# Altium schematic sheet DAC.SchDoc: FMC DAC 1.5GS 4CH
size 420 x 297 mm; EDA_Number: ARTIQ; Projet: ARTIQ/SINARA; Author: G.Kasprowicz; CompanyName: WUT ISE; DrawnBy: G.Kasprowicz; Organization: WUT ISE; Address1: PW ISE; Address2: Nowowiejska 15/19 00-665 Warsaw; Address3: gkasprow@gmail.com; DocumentNumber: 6; Revision: 1; SheetNumber: 6; SheetTotal: 18; ModifiedBy: -; CheckedDate: -; Title2: DAC & filters; DivGrp: WUT ISE; Designer: G.Kasprowicz; ModifiedDate: -; ProjectName: Sensor Box
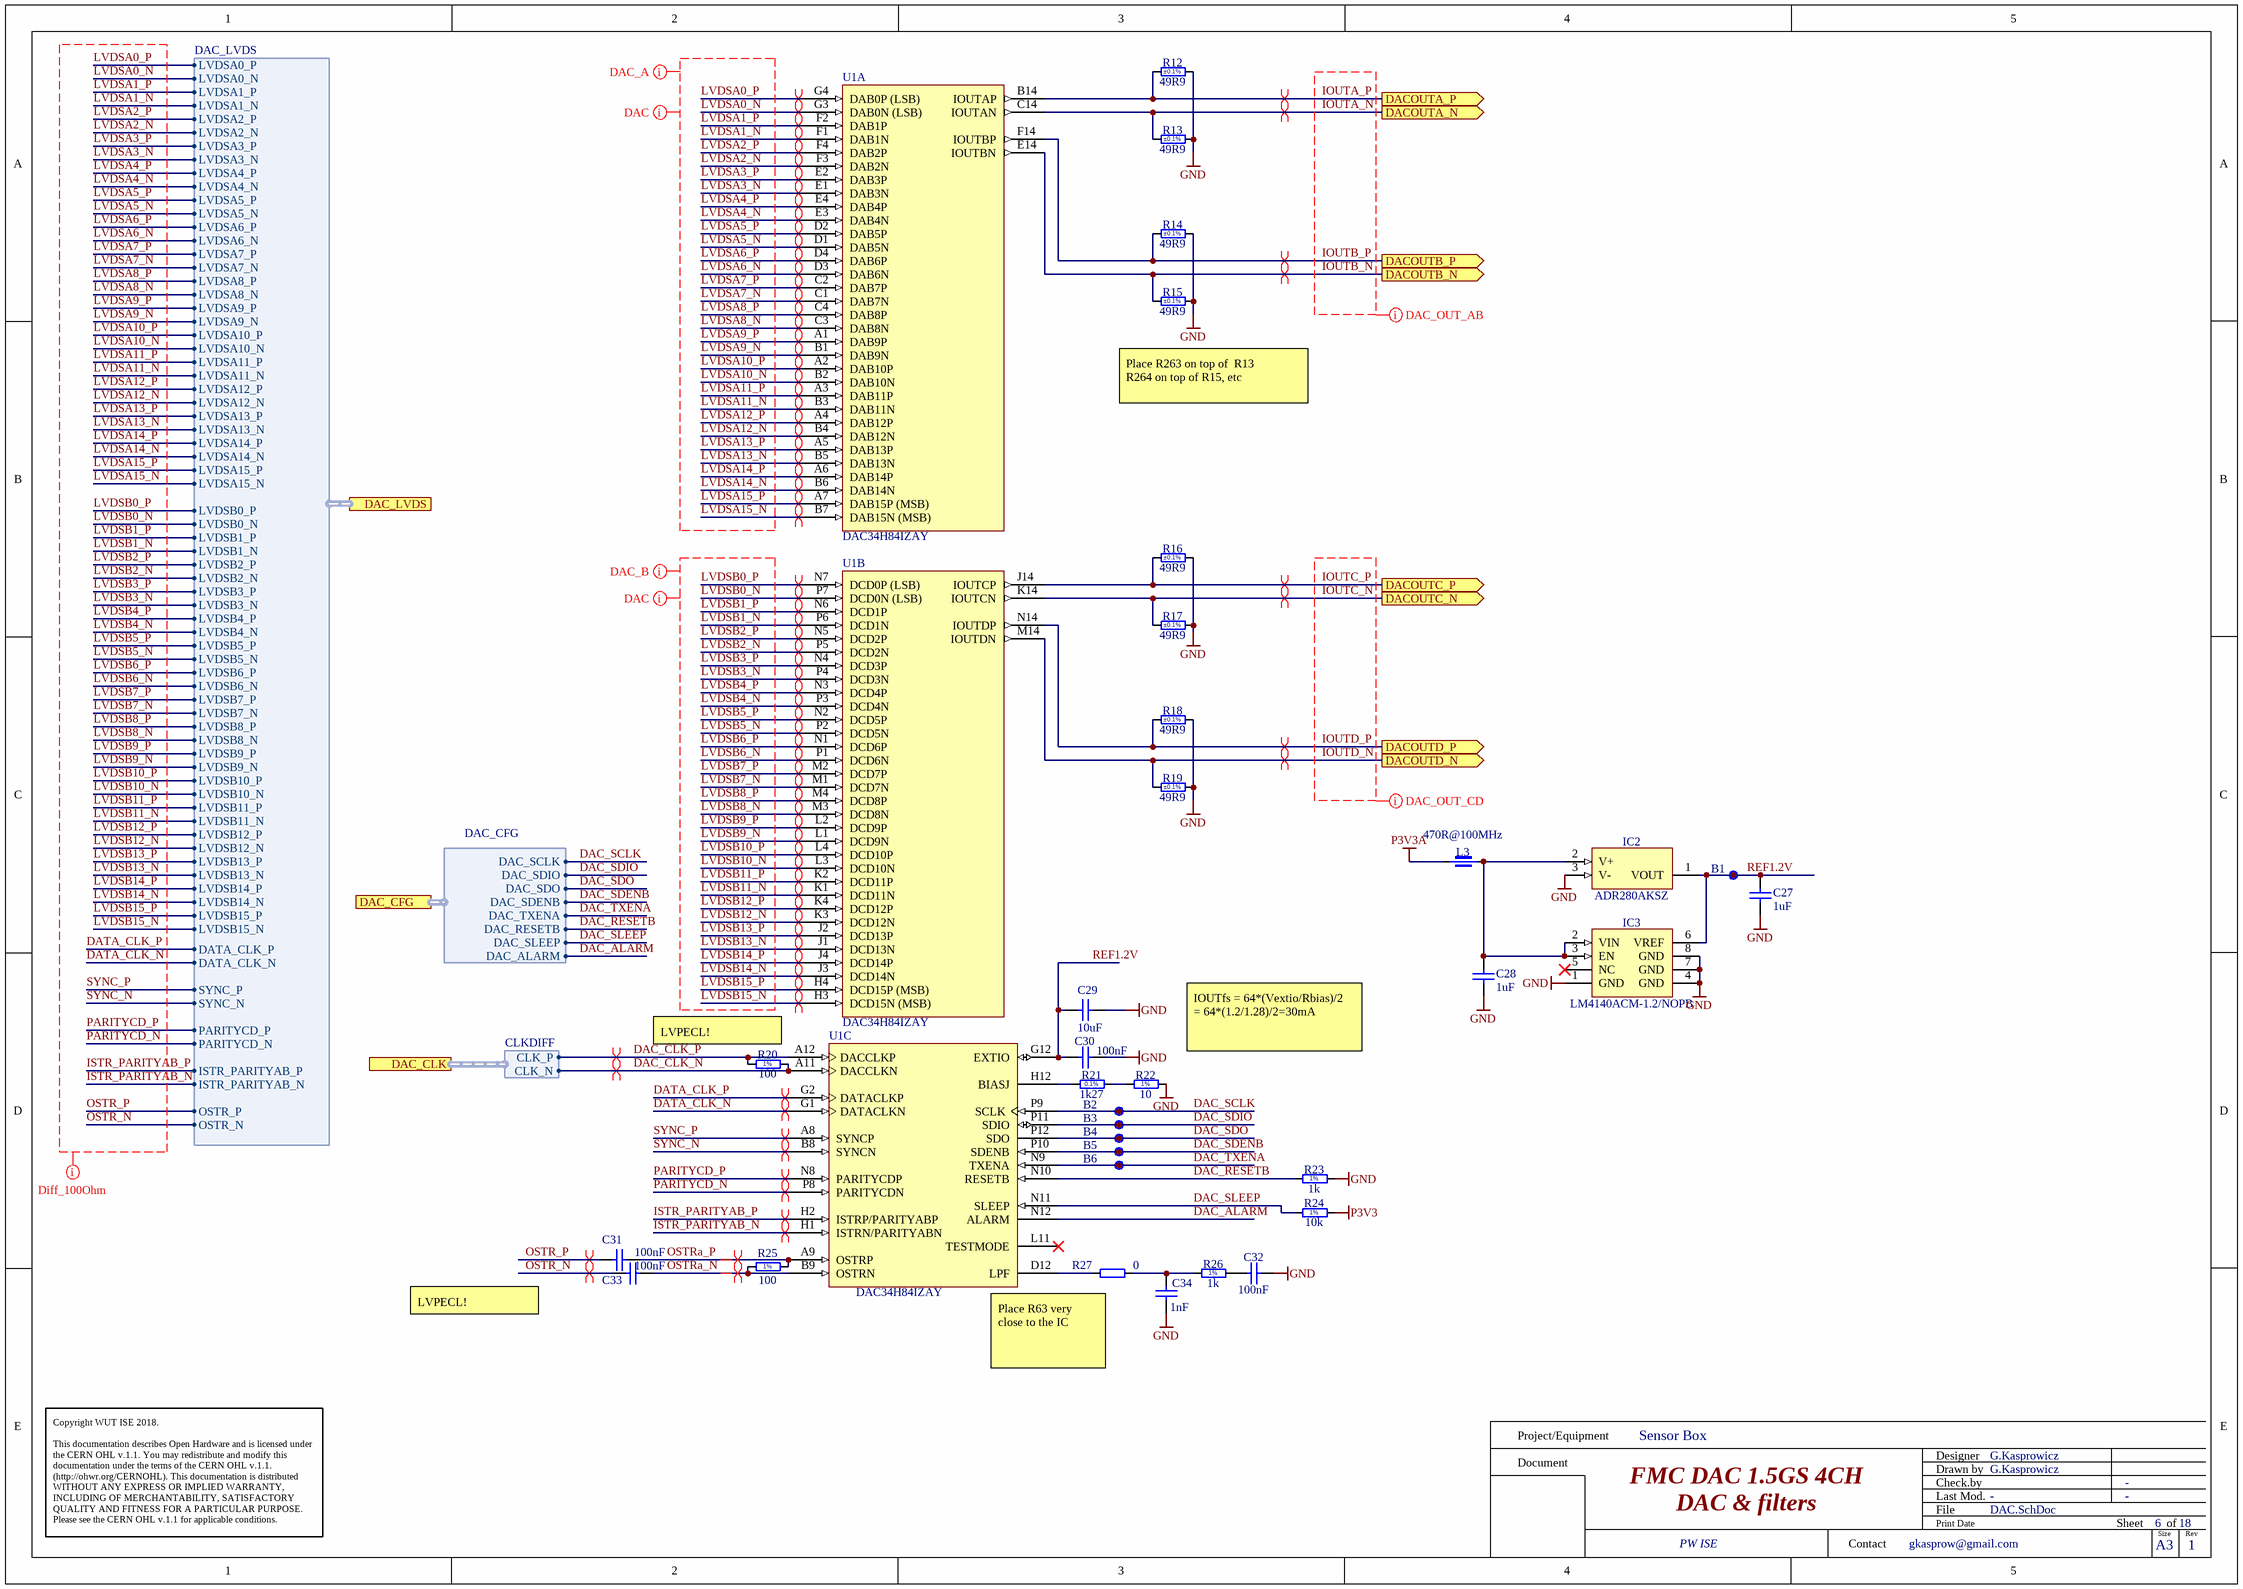
[diagram p0: DAC.SchDoc]

## Parts
B1  SMD Pad  [C100]  (value not drawn)  (no BOM)
B2  SMD Pad  [C100]  (value not drawn)  (no BOM)
B3  SMD Pad  [C100]  (value not drawn)  (no BOM)
B4  SMD Pad  [C100]  (value not drawn)  (no BOM)
B5  SMD Pad  [C100]  (value not drawn)  (no BOM)
B6  SMD Pad  [C100]  (value not drawn)  (no BOM)
C27  1uF  [CAPC1005X55N]
C28  1uF  [CAPC1005X55N]
C29  10uF  [CAPC2012X95N]
C30  100nF  [CAPC1005X55N]
C31  100nF  [CAPC1005X55N]
C32  100nF  [CAPC1005X55N]
C33  100nF  [CAPC1005X55N]
C34  1nF  [CAPC1608X90N]
IC2  ADR280AKSZ  [SOT65P210X110-3N]
IC3  LM4140ACM-1.2/NOPB  [SOIC127P600X175-8N]
L3  470R@100MHz  [INDC1608X95N]
R12  49R9  Tolerance: ±0.1%  [RESC1608X55N]
R13  49R9  Tolerance: ±0.1%  [RESC1608X55N]
R14  49R9  Tolerance: ±0.1%  [RESC1608X55N]
R15  49R9  Tolerance: ±0.1%  [RESC1608X55N]
R16  49R9  Tolerance: ±0.1%  [RESC1608X55N]
R17  49R9  Tolerance: ±0.1%  [RESC1608X55N]
R18  49R9  Tolerance: ±0.1%  [RESC1608X55N]
R19  49R9  Tolerance: ±0.1%  [RESC1608X55N]
R20  100  [RESC0603X28N]
R21  1k27  [RESC1608X55N]
R22  10  [RESC1005X40N]
R23  1k  [RESC1608X55N]
R24  10k  [RESC1608X55N]
R25  100  [RESC0603X28N]
R26  1k  [RESC1608X55N]
R27  0  [RESC1005X40N]
U1  DAC34H84IZAY  [TI-ZAY196]  (parts A,B,C of 5)

## Ports
DAC_CFG (harness DAC_CFG), DAC_CLK (harness CLKDIFF), DAC_LVDS (harness DAC_LVDS), DACOUTA_N (out), DACOUTA_P (out), DACOUTB_N (out), DACOUTB_P (out), DACOUTC_N (out), DACOUTC_P (out), DACOUTD_N (out), DACOUTD_P (out)

## Harnesses
DAC_CFG: DAC_SCLK, DAC_SDIO, DAC_SDO, DAC_SDENB, DAC_TXENA, DAC_RESETB, DAC_SLEEP, DAC_ALARM
CLKDIFF: CLK_N, CLK_P
DAC_LVDS: LVDSA0_P, LVDSA0_N, LVDSA1_P, LVDSA1_N, LVDSA2_P, LVDSA2_N, LVDSA3_P, LVDSA3_N, LVDSA4_P, LVDSA4_N, LVDSA5_P, LVDSA5_N, LVDSA6_P, LVDSA6_N, LVDSA7_P, LVDSA7_N, LVDSA8_P, LVDSA8_N, LVDSA9_P, LVDSA9_N, LVDSA10_P, LVDSA10_N, LVDSA11_P, LVDSA11_N, LVDSA12_P, LVDSA12_N, LVDSA13_P, LVDSA13_N, LVDSA14_P, LVDSA14_N, LVDSA15_P, LVDSA15_N, LVDSB0_P, LVDSB0_N, LVDSB1_P, LVDSB1_N, LVDSB2_P, LVDSB2_N, LVDSB3_P, LVDSB3_N, LVDSB4_P, LVDSB4_N, LVDSB5_P, LVDSB5_N, LVDSB6_P, LVDSB6_N, LVDSB7_P, LVDSB7_N, LVDSB8_P, LVDSB8_N, LVDSB9_P, LVDSB9_N, LVDSB10_P, LVDSB10_N, LVDSB11_P, LVDSB11_N, LVDSB12_P, LVDSB12_N, LVDSB13_P, LVDSB13_N, LVDSB14_P, LVDSB14_N, LVDSB15_P, LVDSB15_N, DATA_CLK_P, DATA_CLK_N, SYNC_P, SYNC_N, PARITYCD_P, PARITYCD_N, ISTR_PARITYAB_P, ISTR_PARITYAB_N, OSTR_P, OSTR_N

## Nets
GND: C27.2 C28.2 C29.1 C30.2 C32.2 C34.1 IC2.3(V-) IC3.1(GND) IC3.4(GND) IC3.7(GND) IC3.8(GND) R12.2 R13.2 R14.2 R15.2 R16.2 R17.2 R18.2 R19.2 R22.2 R23.2
P3V3: R24.2
P3V3A: L3.1
DAC_ALARM: U1.N12(ALARM) ; port DAC_CFG.DAC_ALARM
DAC_CLK_N: R20.2 U1.A11(DACCLKN) ; port DAC_CLK.CLK_N
DAC_CLK_P: R20.1 U1.A12(DACCLKP) ; port DAC_CLK.CLK_P
DAC_RESETB: R23.1 U1.N10(RESETB) ; port DAC_CFG.DAC_RESETB
DAC_SCLK: B2.1 U1.P9(SCLK) ; port DAC_CFG.DAC_SCLK
DAC_SDENB: B5.1 U1.P10(SDENB) ; port DAC_CFG.DAC_SDENB
DAC_SDIO: B3.1 U1.P11(SDIO) ; port DAC_CFG.DAC_SDIO
DAC_SDO: B4.1 U1.P12(SDO) ; port DAC_CFG.DAC_SDO
DAC_SLEEP: R24.1 U1.N11(SLEEP) ; port DAC_CFG.DAC_SLEEP
DAC_TXENA: B6.1 U1.N9(TXENA) ; port DAC_CFG.DAC_TXENA
DATA_CLK_N: U1.G1(DATACLKN) ; port DAC_LVDS.DATA_CLK_N
DATA_CLK_P: U1.G2(DATACLKP) ; port DAC_LVDS.DATA_CLK_P
IOUTA_N: R13.1 U1.C14(IOUTAN) ; port DACOUTA_N
IOUTA_P: R12.1 U1.B14(IOUTAP) ; port DACOUTA_P
IOUTB_N: R15.1 U1.E14(IOUTBN) ; port DACOUTB_N
IOUTB_P: R14.1 U1.F14(IOUTBP) ; port DACOUTB_P
IOUTC_N: R17.1 U1.K14(IOUTCN) ; port DACOUTC_N
IOUTC_P: R16.1 U1.J14(IOUTCP) ; port DACOUTC_P
IOUTD_N: R19.1 U1.M14(IOUTDN) ; port DACOUTD_N
IOUTD_P: R18.1 U1.N14(IOUTDP) ; port DACOUTD_P
ISTR_PARITYAB_N: U1.H1(ISTRN/PARITYABN) ; port DAC_LVDS.ISTR_PARITYAB_N
ISTR_PARITYAB_P: U1.H2(ISTRP/PARITYABP) ; port DAC_LVDS.ISTR_PARITYAB_P
LVDSA0_N: U1.G3(DAB0N_(LSB)) ; port DAC_LVDS.LVDSA0_N
LVDSA0_P: U1.G4(DAB0P_(LSB)) ; port DAC_LVDS.LVDSA0_P
LVDSA1_N: U1.F1(DAB1N) ; port DAC_LVDS.LVDSA1_N
LVDSA1_P: U1.F2(DAB1P) ; port DAC_LVDS.LVDSA1_P
LVDSA2_N: U1.F3(DAB2N) ; port DAC_LVDS.LVDSA2_N
LVDSA2_P: U1.F4(DAB2P) ; port DAC_LVDS.LVDSA2_P
LVDSA3_N: U1.E1(DAB3N) ; port DAC_LVDS.LVDSA3_N
LVDSA3_P: U1.E2(DAB3P) ; port DAC_LVDS.LVDSA3_P
LVDSA4_N: U1.E3(DAB4N) ; port DAC_LVDS.LVDSA4_N
LVDSA4_P: U1.E4(DAB4P) ; port DAC_LVDS.LVDSA4_P
LVDSA5_N: U1.D1(DAB5N) ; port DAC_LVDS.LVDSA5_N
LVDSA5_P: U1.D2(DAB5P) ; port DAC_LVDS.LVDSA5_P
LVDSA6_N: U1.D3(DAB6N) ; port DAC_LVDS.LVDSA6_N
LVDSA6_P: U1.D4(DAB6P) ; port DAC_LVDS.LVDSA6_P
LVDSA7_N: U1.C1(DAB7N) ; port DAC_LVDS.LVDSA7_N
LVDSA7_P: U1.C2(DAB7P) ; port DAC_LVDS.LVDSA7_P
LVDSA8_N: U1.C3(DAB8N) ; port DAC_LVDS.LVDSA8_N
LVDSA8_P: U1.C4(DAB8P) ; port DAC_LVDS.LVDSA8_P
LVDSA9_N: U1.B1(DAB9N) ; port DAC_LVDS.LVDSA9_N
LVDSA9_P: U1.A1(DAB9P) ; port DAC_LVDS.LVDSA9_P
LVDSA10_N: U1.B2(DAB10N) ; port DAC_LVDS.LVDSA10_N
LVDSA10_P: U1.A2(DAB10P) ; port DAC_LVDS.LVDSA10_P
LVDSA11_N: U1.B3(DAB11N) ; port DAC_LVDS.LVDSA11_N
LVDSA11_P: U1.A3(DAB11P) ; port DAC_LVDS.LVDSA11_P
LVDSA12_N: U1.B4(DAB12N) ; port DAC_LVDS.LVDSA12_N
LVDSA12_P: U1.A4(DAB12P) ; port DAC_LVDS.LVDSA12_P
LVDSA13_N: U1.B5(DAB13N) ; port DAC_LVDS.LVDSA13_N
LVDSA13_P: U1.A5(DAB13P) ; port DAC_LVDS.LVDSA13_P
LVDSA14_N: U1.B6(DAB14N) ; port DAC_LVDS.LVDSA14_N
LVDSA14_P: U1.A6(DAB14P) ; port DAC_LVDS.LVDSA14_P
LVDSA15_N: U1.B7(DAB15N_(MSB)) ; port DAC_LVDS.LVDSA15_N
LVDSA15_P: U1.A7(DAB15P_(MSB)) ; port DAC_LVDS.LVDSA15_P
LVDSB0_N: U1.P7(DCD0N_(LSB)) ; port DAC_LVDS.LVDSB0_N
LVDSB0_P: U1.N7(DCD0P_(LSB)) ; port DAC_LVDS.LVDSB0_P
LVDSB1_N: U1.P6(DCD1N) ; port DAC_LVDS.LVDSB1_N
LVDSB1_P: U1.N6(DCD1P) ; port DAC_LVDS.LVDSB1_P
LVDSB2_N: U1.P5(DCD2N) ; port DAC_LVDS.LVDSB2_N
LVDSB2_P: U1.N5(DCD2P) ; port DAC_LVDS.LVDSB2_P
LVDSB3_N: U1.P4(DCD3N) ; port DAC_LVDS.LVDSB3_N
LVDSB3_P: U1.N4(DCD3P) ; port DAC_LVDS.LVDSB3_P
LVDSB4_N: U1.P3(DCD4N) ; port DAC_LVDS.LVDSB4_N
LVDSB4_P: U1.N3(DCD4P) ; port DAC_LVDS.LVDSB4_P
LVDSB5_N: U1.P2(DCD5N) ; port DAC_LVDS.LVDSB5_N
LVDSB5_P: U1.N2(DCD5P) ; port DAC_LVDS.LVDSB5_P
LVDSB6_N: U1.P1(DCD6N) ; port DAC_LVDS.LVDSB6_N
LVDSB6_P: U1.N1(DCD6P) ; port DAC_LVDS.LVDSB6_P
LVDSB7_N: U1.M1(DCD7N) ; port DAC_LVDS.LVDSB7_N
LVDSB7_P: U1.M2(DCD7P) ; port DAC_LVDS.LVDSB7_P
LVDSB8_N: U1.M3(DCD8N) ; port DAC_LVDS.LVDSB8_N
LVDSB8_P: U1.M4(DCD8P) ; port DAC_LVDS.LVDSB8_P
LVDSB9_N: U1.L1(DCD9N) ; port DAC_LVDS.LVDSB9_N
LVDSB9_P: U1.L2(DCD9P) ; port DAC_LVDS.LVDSB9_P
LVDSB10_N: U1.L3(DCD10N) ; port DAC_LVDS.LVDSB10_N
LVDSB10_P: U1.L4(DCD10P) ; port DAC_LVDS.LVDSB10_P
LVDSB11_N: U1.K1(DCD11N) ; port DAC_LVDS.LVDSB11_N
LVDSB11_P: U1.K2(DCD11P) ; port DAC_LVDS.LVDSB11_P
LVDSB12_N: U1.K3(DCD12N) ; port DAC_LVDS.LVDSB12_N
LVDSB12_P: U1.K4(DCD12P) ; port DAC_LVDS.LVDSB12_P
LVDSB13_N: U1.J1(DCD13N) ; port DAC_LVDS.LVDSB13_N
LVDSB13_P: U1.J2(DCD13P) ; port DAC_LVDS.LVDSB13_P
LVDSB14_N: U1.J3(DCD14N) ; port DAC_LVDS.LVDSB14_N
LVDSB14_P: U1.J4(DCD14P) ; port DAC_LVDS.LVDSB14_P
LVDSB15_N: U1.H3(DCD15N_(MSB)) ; port DAC_LVDS.LVDSB15_N
LVDSB15_P: U1.H4(DCD15P_(MSB)) ; port DAC_LVDS.LVDSB15_P
OSTR_N: C33.1 ; port DAC_LVDS.OSTR_N
OSTR_P: C31.1 ; port DAC_LVDS.OSTR_P
OSTRa_N: C33.2 R25.1 U1.B9(OSTRN)
OSTRa_P: C31.2 R25.2 U1.A9(OSTRP)
PARITYCD_N: U1.P8(PARITYCDN) ; port DAC_LVDS.PARITYCD_N
PARITYCD_P: U1.N8(PARITYCDP) ; port DAC_LVDS.PARITYCD_P
REF1.2V: B1.1 C27.1 C29.2 C30.1 IC2.1(VOUT) IC3.6(VREF) U1.G12(EXTIO)
SYNC_N: U1.B8(SYNCN) ; port DAC_LVDS.SYNC_N
SYNC_P: U1.A8(SYNCP) ; port DAC_LVDS.SYNC_P
NetC28_1: C28.1 IC2.2(V+) IC3.2(VIN) IC3.3(EN) L3.2
NetC32_1: C32.1 R26.2
NetC34_2: C34.2 R26.1 R27.1
NetR21_1: R21.1 U1.H12(BIASJ)
NetR21_2: R21.2 R22.1
NetR27_2: R27.2 U1.D12(LPF)

Not connected (* = marked no-connect by the designer): IC3 5(NC)*; U1 L11(TESTMODE)*

## Layout directives
differential pair; differential pair class I_analog: IOUTA_N, IOUTA_P, IOUTB_N, IOUTB_P, IOUTC_N, IOUTC_P, IOUTD_N, IOUTD_P
differential pair; differential pair class LVPECL: DAC_CLK_N, DAC_CLK_P
differential pair; differential pair class Diff_100Ohm; net class DAC: DATA_CLK_N, DATA_CLK_P, ISTR_PARITYAB_N, ISTR_PARITYAB_P, LVDSA0_N, LVDSA0_P, LVDSA1_N, LVDSA1_P, LVDSA2_N, LVDSA2_P, LVDSA3_N, LVDSA3_P, LVDSA4_N, LVDSA4_P, LVDSA5_N, LVDSA5_P, LVDSA6_N, LVDSA6_P, LVDSA7_N, LVDSA7_P, LVDSA8_N, LVDSA8_P, LVDSA9_N, LVDSA9_P, LVDSA10_N, LVDSA10_P, LVDSA11_N, LVDSA11_P, LVDSA12_N, LVDSA12_P, LVDSA13_N, LVDSA13_P, LVDSA14_N, LVDSA14_P, LVDSA15_N, LVDSA15_P, LVDSB0_N, LVDSB0_P, LVDSB1_N, LVDSB1_P, LVDSB2_N, LVDSB2_P, LVDSB3_N, LVDSB3_P, LVDSB4_N, LVDSB4_P, LVDSB5_N, LVDSB5_P, LVDSB6_N, LVDSB6_P, LVDSB7_N, LVDSB7_P, LVDSB8_N, LVDSB8_P, LVDSB9_N, LVDSB9_P, LVDSB10_N, LVDSB10_P, LVDSB11_N, LVDSB11_P, LVDSB12_N, LVDSB12_P, LVDSB13_N, LVDSB13_P, LVDSB14_N, LVDSB14_P, LVDSB15_N, LVDSB15_P, PARITYCD_N, PARITYCD_P, SYNC_N, SYNC_P
differential pair; differential pair class LVPECL; net class DAC: OSTR_N, OSTR_P, OSTRa_N, OSTRa_P
net class DAC_A: LVDSA0_N, LVDSA0_P, LVDSA1_N, LVDSA1_P, LVDSA2_N, LVDSA2_P, LVDSA3_N, LVDSA3_P, LVDSA4_N, LVDSA4_P, LVDSA5_N, LVDSA5_P, LVDSA6_N, LVDSA6_P, LVDSA7_N, LVDSA7_P, LVDSA8_N, LVDSA8_P, LVDSA9_N, LVDSA9_P, LVDSA10_N, LVDSA10_P, LVDSA11_N, LVDSA11_P, LVDSA12_N, LVDSA12_P, LVDSA13_N, LVDSA13_P, LVDSA14_N, LVDSA14_P, LVDSA15_N, LVDSA15_P
net class DAC_B: LVDSB0_N, LVDSB0_P, LVDSB1_N, LVDSB1_P, LVDSB2_N, LVDSB2_P, LVDSB3_N, LVDSB3_P, LVDSB4_N, LVDSB4_P, LVDSB5_N, LVDSB5_P, LVDSB6_N, LVDSB6_P, LVDSB7_N, LVDSB7_P, LVDSB8_N, LVDSB8_P, LVDSB9_N, LVDSB9_P, LVDSB10_N, LVDSB10_P, LVDSB11_N, LVDSB11_P, LVDSB12_N, LVDSB12_P, LVDSB13_N, LVDSB13_P, LVDSB14_N, LVDSB14_P, LVDSB15_N, LVDSB15_P
net class Diff_100Ohm: DATA_CLK_N, DATA_CLK_P, ISTR_PARITYAB_N, ISTR_PARITYAB_P, LVDSA0_N, LVDSA0_P, LVDSA1_N, LVDSA1_P, LVDSA2_N, LVDSA2_P, LVDSA3_N, LVDSA3_P, LVDSA4_N, LVDSA4_P, LVDSA5_N, LVDSA5_P, LVDSA6_N, LVDSA6_P, LVDSA7_N, LVDSA7_P, LVDSA8_N, LVDSA8_P, LVDSA9_N, LVDSA9_P, LVDSA10_N, LVDSA10_P, LVDSA11_N, LVDSA11_P, LVDSA12_N, LVDSA12_P, LVDSA13_N, LVDSA13_P, LVDSA14_N, LVDSA14_P, LVDSA15_N, LVDSA15_P, LVDSB0_N, LVDSB0_P, LVDSB1_N, LVDSB1_P, LVDSB2_N, LVDSB2_P, LVDSB3_N, LVDSB3_P, LVDSB4_N, LVDSB4_P, LVDSB5_N, LVDSB5_P, LVDSB6_N, LVDSB6_P, LVDSB7_N, LVDSB7_P, LVDSB8_N, LVDSB8_P, LVDSB9_N, LVDSB9_P, LVDSB10_N, LVDSB10_P, LVDSB11_N, LVDSB11_P, LVDSB12_N, LVDSB12_P, LVDSB13_N, LVDSB13_P, LVDSB14_N, LVDSB14_P, LVDSB15_N, LVDSB15_P, OSTR_N, OSTR_P, PARITYCD_N, PARITYCD_P, SYNC_N, SYNC_P
net class DAC_OUT_AB: IOUTA_N, IOUTA_P, IOUTB_N, IOUTB_P
net class DAC_OUT_CD: IOUTC_N, IOUTC_P, IOUTD_N, IOUTD_P
net class DAC: LVDSA0_N, LVDSA0_P, LVDSA1_N, LVDSA1_P, LVDSA2_N, LVDSA2_P, LVDSA3_N, LVDSA3_P, LVDSA4_N, LVDSA4_P, LVDSA5_N, LVDSA5_P, LVDSA6_N, LVDSA6_P, LVDSA7_N, LVDSA7_P, LVDSA8_N, LVDSA8_P, LVDSA9_N, LVDSA9_P, LVDSA10_N, LVDSA10_P, LVDSA11_N, LVDSA11_P, LVDSA12_N, LVDSA12_P, LVDSA13_N, LVDSA13_P, LVDSA14_N, LVDSA14_P, LVDSA15_N, LVDSA15_P, LVDSB0_N, LVDSB0_P, LVDSB1_N, LVDSB1_P, LVDSB2_N, LVDSB2_P, LVDSB3_N, LVDSB3_P, LVDSB4_N, LVDSB4_P, LVDSB5_N, LVDSB5_P, LVDSB6_N, LVDSB6_P, LVDSB7_N, LVDSB7_P, LVDSB8_N, LVDSB8_P, LVDSB9_N, LVDSB9_P, LVDSB10_N, LVDSB10_P, LVDSB11_N, LVDSB11_P, LVDSB12_N, LVDSB12_P, LVDSB13_N, LVDSB13_P, LVDSB14_N, LVDSB14_P, LVDSB15_N, LVDSB15_P

## Notes on the sheet
- (near R15) Place R263 on top of  R13
  R264 on top of R15, etc
- (near R20) LVPECL!
- (near R22) IOUTfs = 64*(Vextio/Rbias)/2
  = 64*(1.2/1.28)/2=30mA
- LVPECL!
- Place R63 very close to the IC
- Project/Equipment
- Document
- Designer
- Drawn by
- Check.by
- Copyright WUT ISE 2018.
  This documentation describes Open Hardware and is licensed under the CERN OHL v.1.1. You may redistribute and modify this documentation under the terms of the CERN OHL v.1.1. (http://ohwr.org/CERNOHL). This documentation is distributed WITHOUT ANY EXPRESS OR IMPLIED WARRANTY, INCLUDING OF MERCHANTABILITY, SATISFACTORY QUALITY AND FITNESS FOR A PARTICULAR PURPOSE. Please see the CERN OHL v.1.1 for applicable conditions.
- Contact
- File
- Last Mod.
- Print Date
- Sheet
- Size
- A3
- of
- Rev
- (in symbol R0201_100R_1%_0.05W_200PPM) 1%
- (in symbol R0402_10R_1%_0.0625W_200PPM) 1%
- (in symbol R0603_1K27_0.1%_0.063W_10PPM) 0.1%
- (in symbol R0603_1K_1%_0.1W_100PPM) 1%
- (in symbol R0603_10K_1%_0.1W_100PPM) 1%

## Library data of the parts
B1-B6 = SMD_PAD_D1MM: Through Hole Pad; Part Description: 1mm Diameter SMD Pad; Mounted: No; Part Number: SMD_PAD_D1MM; Component Type: Standard (No BOM); Pin Count: 1; Family: SMD Pad; Socket: No; SMD: No; Sense: No; Status: None; ComponentHeight: 0mm; HelpURL: Undefined; Author: CERN DEM JLC; CreateDate: 10.10.2017; LatestRevisionDate: 10.10.2017; PackageDescription: 1mm Diameter SMD Pad
C27 C28 = CC0402_1UF_16V_10%_X5R: Non-polarised capacitor; Part Description: SMD Multilayer Chip Ceramic Capacitor; Manufacturer: GENERIC; Manufacturer1 Part Number: C1005X5R1C105KT; Voltage: 16V; TC: X5R; Tolerance: ±10%; Part Number: CC0402_1UF_16V_10%_X5R; Component Kind: Standard; Component Type: Standard; Pin Count: 2; Value: 1uF; Status: Preferred; Manufacturer Part Number: CC0402_1UF_16V_10%_X5R; Case: 0402; Mounted: Yes; Socket: No; SMD: Yes; Sense: No; Manufacturer1 Example: TDK; Manufacturer1 ComponentHeight: 0.55mm; HelpURL: \\cern.ch\dfs\Applications\Altium\Datasheets\CC0402_X5R_TDK_C.pdf; Author: CERN DEM JLC; CreateDate: 2012-10-25; LatestRevisionDate: 2012-10-25
C29 = CC0805_10UF_25V_10%_X5R: Non-polarised capacitor; Part Description: SMD Multilayer Chip Ceramic Capacitor; Manufacturer: GENERIC; Manufacturer1 Part Number: GRM219R61E106KA12D; Voltage: 25V; TC: X5R; Tolerance: ±10%; Part Number: CC0805_10UF_25V_10%_X5R; Component Kind: Standard; Component Type: Standard; Pin Count: 2; Value: 10uF; Status: Preferred; Manufacturer Part Number: CC0805_10UF_25V_10%_X5R; Case: 0805; Mounted: Yes; Socket: No; SMD: Yes; Sense: No; Manufacturer1 Example: MURATA; Manufacturer1 ComponentHeight: 0.95mm; HelpURL: \\cern.ch\dfs\Applications\Altium\Datasheets\CC0805_X5R_MURATA_GRM.pdf; Author: CERN DEM JLC; CreateDate: 25.10.2012; LatestRevisionDate: 06.09.2016
C30-C33 = CC0402_100NF_16V_10%_X5R: Non-polarised capacitor; Part Description: SMD Multilayer Chip Ceramic Capacitor; Manufacturer: GENERIC; Manufacturer1 Part Number: GRM155R61C104KA88D; Voltage: 16V; TC: X5R; Tolerance: ±10%; Part Number: CC0402_100NF_16V_10%_X5R; Component Kind: Standard; Component Type: Standard; Pin Count: 2; Value: 100nF; Status: None; Manufacturer Part Number: CC0402_100NF_16V_10%_X5R; Case: 0402; Mounted: Yes; Socket: No; SMD: Yes; Sense: No; Manufacturer1 Example: MURATA; Manufacturer1 ComponentHeight: 0.55mm; HelpURL: \\cern.ch\dfs\Applications\Altium\Datasheets\CC0402_X5R_MURATA_GRM.pdf; Author: CERN DEM JLC; CreateDate: 10.12.2013; LatestRevisionDate: 10.12.2013
C34 = CC0603_1NF_50V_1%_NP0: Non-polarised capacitor; Part Description: SMD Multilayer Chip Ceramic Capacitor; Manufacturer: GENERIC; Manufacturer1 Part Number: 06035A102FAT2A; Voltage: 50V; TC: C0G/NP0; Tolerance: ±1%; Part Number: CC0603_1NF_50V_1%_NP0; Component Kind: Standard; Component Type: Standard; Pin Count: 2; Value: 1nF; Status: None; Manufacturer Part Number: CC0603_1NF_50V_1%_NP0; Case: 0603; Mounted: Yes; Socket: No; SMD: Yes; Sense: No; Manufacturer1 Example: AVX; Manufacturer1 ComponentHeight: 0.9mm; HelpURL: \\cern.ch\dfs\Applications\Altium\Datasheets\CC0603_C0G_AVX.pdf; Author: CERN DEM JLC; CreateDate: 15.06.2017; LatestRevisionDate: 15.06.2017
IC2 = ADR280AKSZ: 1.2 V Ultralow Power High PSRR Voltage Reference; Manufacturer: ANALOG DEVICES; PressFit: No; Bonding: No; Part Number: ADR280AKSZ; Component Kind: Standard; Component Type: Standard; Device: ADR280AKSZ; PackageDescription: SOT323, 0.65mm pitch; 3 pin, 1.25mm W X 2.00mm L, IPC Medium Density; Part Description: 1.2 V Ultralow Power High PSRR Voltage Reference; Manufacturer Part Number: ADR280AKSZ; Pin Count: 3; Case: SOT323; Mounted: Yes; Socket: No; SMD: Yes; Sense: No; ComponentHeight: 1.1mm; HelpURL: \\cern.ch\dfs\Applications\Altium\Datasheets\ADR280AKSZ.pdf; Author: CERN DEM JLC; CreateDate: 08.08.2018; LatestRevisionDate: 08.08.2018
IC3 = LM4140ACM-1.2/NOPB: High Precision Low Noise Low Dropout Voltage Reference; Part Description: 1.2V 0.1% 3 ppm/°C, High Precision Low Noise Low Dropout Voltage Reference; Manufacturer: TEXAS INSTRUMENTS; PressFit: No; Bonding: No; Part Number: LM4140ACM-1.2/NOPB; Component Kind: Standard; Component Type: Standard; Device: LM4140ACM-1.2/NOPB; PackageDescription: SOIC 8, Pitch 1.27mm, Body 4x5mm, IPC Medium Density; Manufacturer Part Number: LM4140ACM-1.2/NOPB; Pin Count: 8; Case: SOIC8; Mounted: Yes; Socket: No; SMD: Yes; Sense: No; ComponentHeight: 1.75mm; HelpURL: \\cern.ch\dfs\Applications\Altium\Datasheets\LM4140ACM-1.2-NOPB.pdf; Author: CERN DEM JLC; CreateDate: 17.11.2014; LatestRevisionDate: 17.11.2014
L3 = IND0603_MURATA_BLM18PG471SN1D: Part Description: SMD EMIFIL Chip Ferrite Bead; Manufacturer: MURATA; Power: 1A; Resistance: 0.2R; Tolerance: ±25%; Part Number: IND0603_MURATA_BLM18PG471SN1D; Component Kind: Standard; Component Type: Standard; Pin Count: 2; Value: 470R@100MHz; Manufacturer Part Number: BLM18PG471SN1D; Case: 0603; Mounted: Yes; Socket: No; SMD: Yes; Sense: No; ComponentHeight: 0.95mm; HelpURL: \\cern.ch\dfs\Applications\Altium\Datasheets\IND0603_MURATA_BLM18P.pdf; Author: CERN DEM BC; CreateDate: 17.02.2021; LatestRevisionDate: 17.02.2021
R12-R19 = R0603_49R9_0.1%_0.063W_10PPM: Resistor - 0.1%; Part Description: Thin Film Chip Resistor; Manufacturer: GENERIC; Manufacturer1 Part Number: RN73C1J49R9BTDF; Power: 0.063W; TC: ±10ppm; PressFit: No; Part Number: R0603_49R9_0.1%_0.063W_10PPM; Component Kind: Standard; Component Type: Standard; Pin Count: 2; Value: 49R9; Status: Not Recommended; Manufacturer Part Number: R0603_49R9_0.1%_0.063W_10PPM; Case: 0603; Mounted: Yes; Sense: No; Socket: No; SMD: Yes; Manufacturer1 Example: TYCO HOLSWORTHY; Manufacturer1 ComponentHeight: 0.5mm; HelpURL: \\cern.ch\dfs\Applications\Altium\Datasheets\R0603_Tyco_RN73.pdf; Author: CERN DEM JLC; CreateDate: 03.12.2007; LatestRevisionDate: 13.03.2008
R20 R25 = R0201_100R_1%_0.05W_200PPM: Resistor - 1%; Part Description: Thick Film Chip Resistor; Manufacturer: GENERIC; Manufacturer1 Part Number: CRCW0201100RFNED; Power: 0.05W; TC: ±200ppm/°C; PressFit: No; Part Number: R0201_100R_1%_0.05W_200PPM; Component Kind: Standard; Component Type: Standard; Pin Count: 2; Value: 100; Status: Not Recommended; Tolerance: ±1%; Manufacturer Part Number: R0201_100R_1%_0.05W_200PPM; Case: 0201; Mounted: Yes; Sense: No; Socket: No; SMD: Yes; Manufacturer1 Example: VISHAY; Manufacturer1 ComponentHeight: 0.27mm; HelpURL: \\cern.ch\dfs\Applications\Altium\Datasheets\R0201_VISHAY_CRCW0201 e3.pdf; Author: CERN DEM JLC; CreateDate: 13.11.2014; LatestRevisionDate: 13.11.2014
R21 = R0603_1K27_0.1%_0.063W_10PPM: Resistor - 0.1%; Part Description: Thin Film Chip Resistor; Manufacturer: GENERIC; Manufacturer1 Part Number: RN73C1J1K27BTDF; Power: 0.063W; TC: ±10ppm; PressFit: No; Part Number: R0603_1K27_0.1%_0.063W_10PPM; Component Kind: Standard; Component Type: Standard; Pin Count: 2; Value: 1k27; Status: Not Recommended; Tolerance: ±0.1%; Manufacturer Part Number: R0603_1K27_0.1%_0.063W_10PPM; Case: 0603; Mounted: Yes; Sense: No; Socket: No; SMD: Yes; Manufacturer1 Example: TYCO HOLSWORTHY; Manufacturer1 ComponentHeight: 0.5mm; HelpURL: \\cern.ch\dfs\Applications\Altium\Datasheets\R0603_Tyco_RN73.pdf; Author: CERN DEM JLC; CreateDate: 03.12.2007; LatestRevisionDate: 13.03.2008
R22 = R0402_10R_1%_0.0625W_200PPM: Resistor - 1%; Part Description: General Purpose Thick Film Chip Resistor; Manufacturer: GENERIC; Manufacturer1 Part Number: 232270671009L; TC: ±200ppm/°C; PressFit: No; Part Number: R0402_10R_1%_0.0625W_200PPM; Component Kind: Standard; Component Type: Standard; Pin Count: 2; Value: 10; Status: Not Recommended; Power: 0.0625W; Tolerance: ±1%; Manufacturer Part Number: R0402_10R_1%_0.0625W_200PPM; Case: 0402; Mounted: Yes; Sense: No; Socket: No; SMD: Yes; Manufacturer1 Example: YAGEO PHYCOMP; Manufacturer1 ComponentHeight: 0.4mm; HelpURL: \\cern.ch\dfs\Applications\Altium\Datasheets\R0402_Phycomp_RC0402.pdf; Author: CERN DEM JLC; CreateDate: 24.06.2009; LatestRevisionDate: 17.10.2012
R23 R26 = R0603_1K_1%_0.1W_100PPM: Resistor - 1%; Part Description: General Purpose Thick Film Chip Resistor; Manufacturer: GENERIC; Manufacturer1 Part Number: NRC06F1001TRF; Power: 0.1W; TC: ±100ppm/°C; PressFit: No; Part Number: R0603_1K_1%_0.1W_100PPM; Component Kind: Standard; Component Type: Standard; Pin Count: 2; Value: 1k; Status: Preferred; Tolerance: ±1%; Manufacturer Part Number: R0603_1K_1%_0.1W_100PPM; Case: 0603; Mounted: Yes; Sense: No; Socket: No; SMD: Yes; Manufacturer1 Example: NIC COMPONENT; Manufacturer1 ComponentHeight: 0.55mm; HelpURL: \\cern.ch\dfs\Applications\Altium\Datasheets\R0603_NIC_NRC.pdf; Author: CERN DEM JLC; CreateDate: 03.12.2007; LatestRevisionDate: 13.03.2008
R24 = R0603_10K_1%_0.1W_100PPM: Resistor - 1%; Part Description: General Purpose Thick Film Chip Resistor; Manufacturer: GENERIC; Manufacturer1 Part Number: NRC06F1002TRF; Power: 0.1W; TC: ±100ppm/°C; PressFit: No; Part Number: R0603_10K_1%_0.1W_100PPM; Component Kind: Standard; Component Type: Standard; Pin Count: 2; Value: 10k; Status: Preferred; Tolerance: ±1%; Manufacturer Part Number: R0603_10K_1%_0.1W_100PPM; Case: 0603; Mounted: Yes; Sense: No; Socket: No; SMD: Yes; Manufacturer1 Example: NIC COMPONENT; Manufacturer1 ComponentHeight: 0.55mm; HelpURL: \\cern.ch\dfs\Applications\Altium\Datasheets\R0603_NIC_NRC.pdf; Author: CERN DEM JLC; CreateDate: 03.12.2007; LatestRevisionDate: 13.03.2008
R27 = R0402_0R_JUMPER: Resistor; Part Description: 1A (0.05R Max DC Resistance) Zero Ohm Jumper; Manufacturer: GENERIC; Manufacturer1 Part Number: 232270591001L; Part Number: R0402_0R_JUMPER; Component Kind: Standard; Component Type: Standard; Pin Count: 2; Value: 0; Status: Not recommended; Manufacturer Part Number: R0402_0R_JUMPER; Case: 0402; Mounted: Yes; Sense: No; Socket: No; SMD: Yes; Manufacturer1 Example: YAGEO PHYCOMP; Manufacturer1 ComponentHeight: 0.4mm; HelpURL: \\cern.ch\dfs\Applications\Altium\Datasheets\R0402_Phycomp_RC0402.pdf; Author: CERN DEM JLC; CreateDate: 2007-12-03; LatestRevisionDate: 2012-10-17
U1 = CMP-0004-01532-1: Quad-Channel, 16-Bit, 1.5 GSPS DAC, -40 to 85 degC, 196-pin BGA (ZAY196), Green (RoHS & no Sb/Br); Manufacturer: Texas Instruments; Interface: Parallel LVDS; Resolution(Bits): 16; SubFamily: High Speed DAC (>10MSPS); Power Consumption(Typ)(mW): 1828; SFDR(dB): 78; DAC Channels: 4; Mounting Technology: Surface Mount; ComponentLink3URL: http://www.ti.com/litv/pdf/mpbga11; PartNumber: DAC34H84IZAY; ComponentLink1Description: Manufacturer URL; Eco-Plan: Green (RoHS & no Sb/Br); PackageDescription: 196-Pin Plastic Ball Grid Array, Body 12 x 12 mm, Pitch 0.8 mm; PackageVersion: 4208324-4/C, 09/2010; PackageReference: ZAY196; ComponentLink1URL: http://www.ti.com/; ComponentLink2URL: http://www.ti.com/general/docs/lit/getliterature.tsp?genericPartNumber=DAC34SH84&fileType=pdf; DatasheetVersion: SLAS808D; ComponentLink3Description: Package Specification; ComponentLink2Description: Datasheet